# Altium schematic sheet motor subsheet 1.SchDoc
size A3
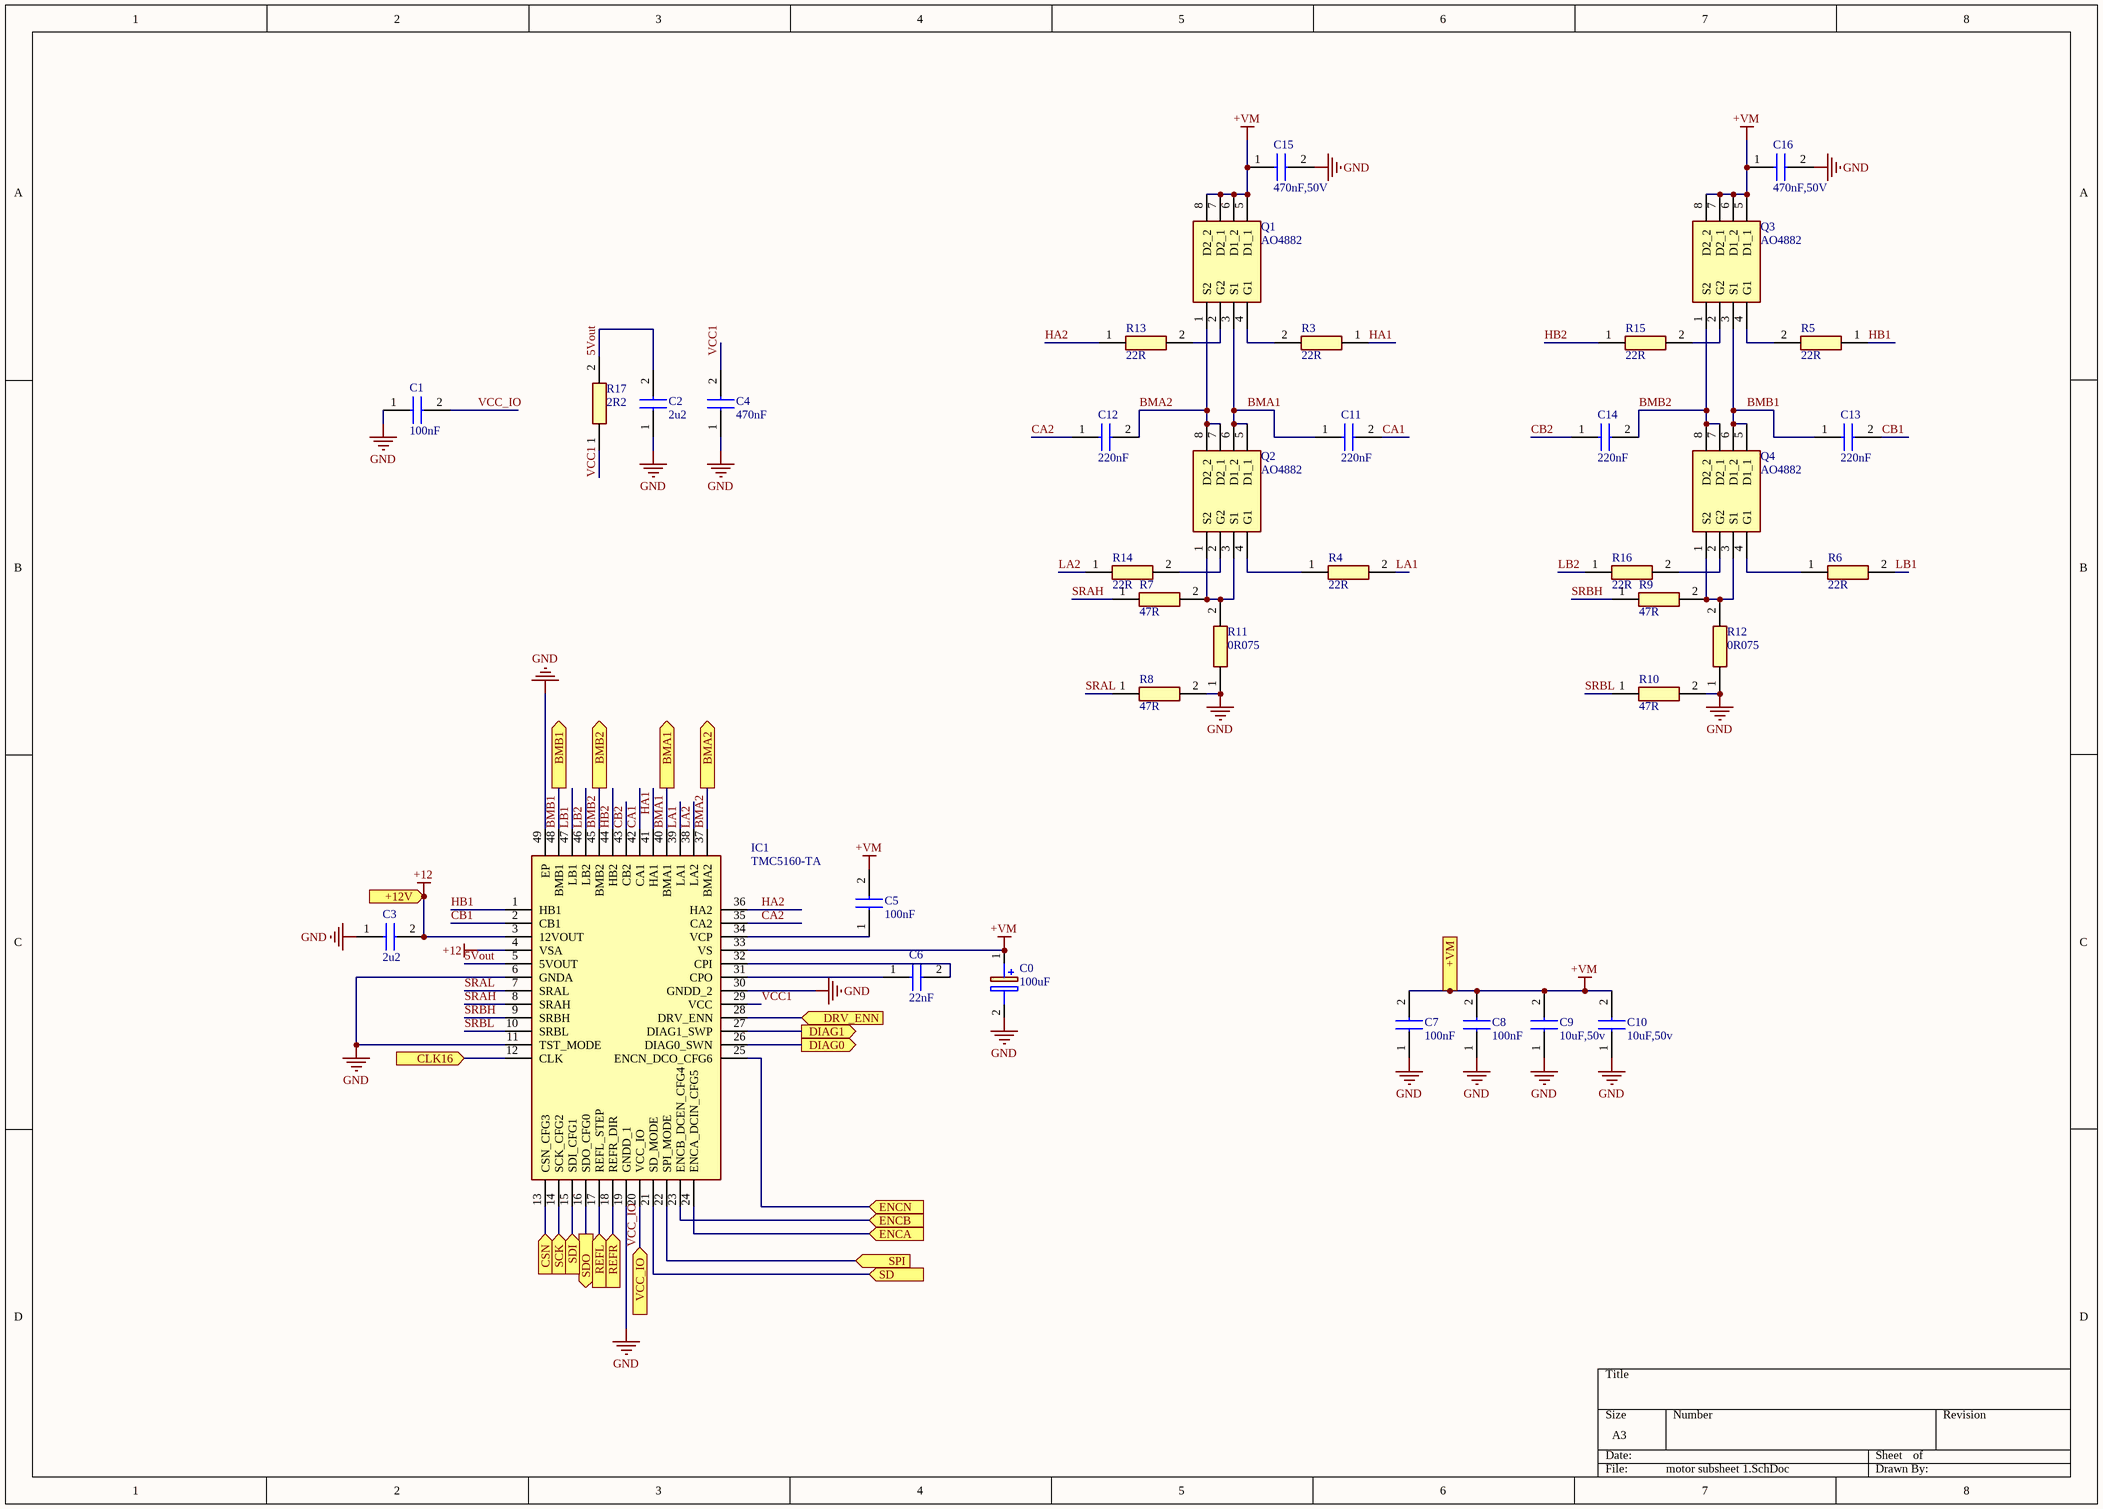
[diagram p0: motor subsheet 1.SchDoc]

## Parts
C0  100uF  [CAPAE850X1050N]
C1  100nF  [CAPC1608X90N]
C2  2u2  [CAPC1608X90N]
C3  2u2  [CAPC1608X90N]
C4  470nF  [CAPC1608X90N]
C5  100nF  [CAPC1608X90N]
C6  22nF  [CAPC1608X90N]
C7  100nF  [CAPC1608X90N]
C8  100nF  [CAPC1608X90N]
C9  10uF,50v  [CAPC3216X180N]
C10  10uF,50v  [CAPC3216X180N]
C11  220nF  [CAPC1608X90N]
C12  220nF  [CAPC1608X90N]
C13  220nF  [CAPC1608X90N]
C14  220nF  [CAPC1608X90N]
C15  470nF,50V  [C1608_Commercial]
C16  470nF,50V  [C1608_Commercial]
IC1  TMC5160-TA  [QFP50P900X900X120-49N]
Q1  AO4882  [SOIC127P600X175-8N]
Q2  AO4882  [SOIC127P600X175-8N]
Q3  AO4882  [SOIC127P600X175-8N]
Q4  AO4882  [SOIC127P600X175-8N]
R3  22R  [RESC1608X55N]
R4  22R  [RESC1608X55N]
R5  22R  [RESC1608X55N]
R6  22R  [RESC1608X55N]
R7  47R  [RESC1608X60N]
R8  47R  [RESC1608X60N]
R9  47R  [RESC1608X60N]
R10  47R  [RESC1608X60N]
R11  0R075  [ERJ8_B_BW_R_LW_CW_D]
R12  0R075  [ERJ8_B_BW_R_LW_CW_D]
R13  22R  [RESC1608X55N]
R14  22R  [RESC1608X55N]
R15  22R  [RESC1608X55N]
R16  22R  [RESC1608X55N]
R17  2R2  [RESC1608X55N]

## Ports
+12V (in), +VM (in), BMA1 (out), BMA2 (out), BMB1 (out), BMB2 (out), CLK16 (in), CSN (in), DIAG0 (out), DIAG1 (out), DRV_ENN (in), ENCA (in), ENCB (in), ENCN (in), REFL (in), REFR (in), SCK (in), SD (in), SDI (in), SDO (out), SPI (in), VCC_IO (in)

## Nets
+12: C3.2 IC1.3(12VOUT) IC1.4(VSA) ; port +12V
+VM: C0.1(+) C5.2 C7.2 C8.2 C9.2 C10.2 C15.1 C16.1 IC1.33(VS) Q1.5(D1_1) Q1.6(D1_2) Q1.7(D2_1) Q1.8(D2_2) Q3.5(D1_1) Q3.6(D1_2) Q3.7(D2_1) Q3.8(D2_2) ; port +VM
GND: C0.2(-) C1.1 C2.1 C3.1 C4.1 C7.1 C8.1 C9.1 C10.1 C15.2 C16.2 IC1.6(GNDA) IC1.11(TST_MODE) IC1.19(GNDD_1) IC1.30(GNDD_2) IC1.49(EP) R8.2 R10.2 R11.1 R12.1
5Vout: C2.2 IC1.5(5VOUT) R17.2
BMA1: C11.1 IC1.40(BMA1) Q1.3(S1) Q2.5(D1_1) Q2.6(D1_2) ; port BMA1
BMA2: C12.2 IC1.37(BMA2) Q1.1(S2) Q2.7(D2_1) Q2.8(D2_2) ; port BMA2
BMB1: C13.1 IC1.48(BMB1) Q3.3(S1) Q4.5(D1_1) Q4.6(D1_2) ; port BMB1
BMB2: C14.2 IC1.45(BMB2) Q3.1(S2) Q4.7(D2_1) Q4.8(D2_2) ; port BMB2
CA1: C11.2 IC1.42(CA1)
CA2: C12.1 IC1.35(CA2)
CB1: C13.2 IC1.2(CB1)
CB2: C14.1 IC1.43(CB2)
CLK16: IC1.12(CLK) ; port CLK16
CSN: IC1.13(CSN_CFG3) ; port CSN
DIAG0: IC1.26(DIAG0_SWN) ; port DIAG0
DIAG1: IC1.27(DIAG1_SWP) ; port DIAG1
DRV_ENN: IC1.28(DRV_ENN) ; port DRV_ENN
ENCA: IC1.24(ENCA_DCIN_CFG5) ; port ENCA
ENCB: IC1.23(ENCB_DCEN_CFG4) ; port ENCB
ENCN: IC1.25(ENCN_DCO_CFG6) ; port ENCN
HA1: IC1.41(HA1) R3.1
HA2: IC1.36(HA2) R13.1
HB1: IC1.1(HB1) R5.1
HB2: IC1.44(HB2) R15.1
LA1: IC1.39(LA1) R4.2
LA2: IC1.38(LA2) R14.1
LB1: IC1.47(LB1) R6.2
LB2: IC1.46(LB2) R16.1
REFL: IC1.17(REFL_STEP) ; port REFL
REFR: IC1.18(REFR_DIR) ; port REFR
SCK: IC1.14(SCK_CFG2) ; port SCK
SD: IC1.21(SD_MODE) ; port SD
SDI: IC1.15(SDI_CFG1) ; port SDI
SDO: IC1.16(SDO_CFG0) ; port SDO
SPI: IC1.22(SPI_MODE) ; port SPI
SRAH: IC1.8(SRAH) R7.1
SRAL: IC1.7(SRAL) R8.1
SRBH: IC1.9(SRBH) R9.1
SRBL: IC1.10(SRBL) R10.1
VCC1: C4.2 IC1.29(VCC) R17.1
VCC_IO: C1.2 IC1.20(VCC_IO) ; port VCC_IO
NetC5_1: C5.1 IC1.34(VCP)
NetC6_1: C6.1 IC1.31(CPO)
NetC6_2: C6.2 IC1.32(CPI)
NetQ1_2: Q1.2(G2) R13.2
NetQ1_4: Q1.4(G1) R3.2
NetQ2_1: Q2.1(S2) Q2.3(S1) R7.2 R11.2
NetQ2_2: Q2.2(G2) R14.2
NetQ2_4: Q2.4(G1) R4.1
NetQ3_2: Q3.2(G2) R15.2
NetQ3_4: Q3.4(G1) R5.2
NetQ4_1: Q4.1(S2) Q4.3(S1) R9.2 R12.2
NetQ4_2: Q4.2(G2) R16.2
NetQ4_4: Q4.4(G1) R6.1

## Library data of the parts
C0 = MAL215097011E3: Capacitor Polarised / MAL215097011E3; Manufacturer_Name: Vishay; Datasheet Link: http://www.vishay.com/docs/28395/150crz.pdf; Height: 10.5mm; Manufacturer_Part_Number: MAL215097011E3; Mouser Part Number: 594-MAL215097011E3; Mouser Price/Stock: https://www.mouser.co.uk/ProductDetail/Vishay-BC-Components/MAL215097011E3?qs=qmStTZH4TzmmMfVG5I6TQQ%3D%3D; Arrow Part Number: MAL215097011E3; Arrow Price/Stock: https://www.arrow.com/en/products/mal215097011e3/vishay
C1-C8 C11-C14 = GCM188R71H224KA64D: Capacitor; Manufacturer_Name: Murata Electronics; Datasheet Link: https://psearch.en.murata.com/capacitor/product/GCM188R71H224KA64%23.html; Height: 0.9mm; Manufacturer_Part_Number: GCM188R71H224KA64D; Mouser Part Number: 81-GCM188R71H224K64D; Mouser Price/Stock: https://www.mouser.co.uk/ProductDetail/Murata-Electronics/GCM188R71H224KA64D?qs=Kk8YaIHLBVBgtUYYs%2FZrtQ%3D%3D; Arrow Part Number: GCM188R71H224KA64D; Arrow Price/Stock: https://www.arrow.com/en/products/gcm188r71h224ka64d/murata-manufacturing
  C1 C5 C7 C8: LCSC Part #: C161181
  C2: LCSC Part #: C77047
  C3: LCSC Part #: *
  C4: LCSC Part #: C170149
  C6: LCSC Part #: C354353
  C11-C14: LCSC Part #: C97857
C9 C10 = GRM31CR61H106MA12L: Capacitor; Manufacturer_Name: Murata Electronics; Datasheet Link: https://datasheet.datasheetarchive.com/originals/distributors/DKDS-10/192395.pdf; Height: 1.8mm; Manufacturer_Part_Number: GRM31CR61H106MA12L; Mouser Part Number: 81-GRM31CR61H106MA2L; Mouser Price/Stock: https://www.mouser.co.uk/ProductDetail/Murata-Electronics/GRM31CR61H106MA12L/?qs=eeBpzGFlv%252B9KISFXBDHybg%3D%3D; Arrow Part Number: GRM31CR61H106MA12L; Arrow Price/Stock: https://www.arrow.com/en/products/grm31cr61h106ma12l/murata-manufacturing?region=europe; LCSC Part #: C882507
C15 C16 = C1608X7R1H474K080AC: Capacitor; Manufacturer_Name: TDK; Datasheet Link: https://product.tdk.com/system/files/dam/doc/product/capacitor/ceramic/mlcc/catalog/mlcc_commercial_general_en.pdf; Height: 0.9mm; Manufacturer_Part_Number: C1608X7R1H474K080AC; Mouser Part Number: 810-C1608X7R1H474K; Mouser Price/Stock: https://www.mouser.co.uk/ProductDetail/TDK/C1608X7R1H474K080AC?qs=NRhsANhppD8WKA9kPBtdag%3D%3D; LCSC Part #: C170149
IC1 = TMC5160-TA: Integrated Circuit; Manufacturer_Name: TRINAMIC; Datasheet Link: https://datasheet.datasheetarchive.com/originals/distributors/DKDS-40/47761.pdf; Height: 1.2mm; Manufacturer_Part_Number: TMC5160-TA; LCSC Part #: C516354
Q1-Q4 = AO4882: MOSFET (N-Channel); Manufacturer_Name: Alpha & Omega Semiconductors; Datasheet Link: http://www.aosmd.com/res/data_sheets/AO4882.pdf; Height: 1.75mm; Manufacturer_Part_Number: AO4882; Arrow Part Number: AO4882; Arrow Price/Stock: https://www.arrow.com/en/products/ao4882/alpha-and-omega-semiconductor?region=nac; LCSC Part #: C3040598
R3-R6 R13-R17 = MC0063W06031100K: Resistor; Manufacturer_Name: MULTICOMP; Datasheet Link: http://uk.farnell.com/multicomp/mc0063w06031105k/res-thick-film-105k-1-0-063w-0603/dp/1170988; Height: 0.55mm; Manufacturer_Part_Number: MC0063W06031100K
  R3-R6 R13-R16: LCSC Part #: C122707
  R17: LCSC Part #: C269422
R7-R10 = MCSR06X47R0FTL: Resistor; Manufacturer_Name: MULTICOMP; Datasheet Link: http://www.farnell.com/datasheets/1716710.pdf?_ga=1.256651403.1411154270.1472651675; Height: 0.6mm; Manufacturer_Part_Number: MCSR06X47R0FTL; LCSC Part #: C2136913
R11 R12 = ERJ-8BWFR075V: Resistor; Manufacturer_Name: Panasonic; Datasheet Link: http://industrial.panasonic.com/cdbs/www-data/pdf/RDN0000/AOA0000C313.pdf; Manufacturer_Part_Number: ERJ-8BWFR075V; Mouser Part Number: 667-ERJ-8BWFR075V; Mouser Price/Stock: https://www.mouser.co.uk/ProductDetail/Panasonic/ERJ-8BWFR075V?qs=KH2o3k57USiX44P74%2FQfRA%3D%3D; Arrow Part Number: ERJ-8BWFR075V; Arrow Price/Stock: https://www.arrow.com/en/products/erj-8bwfr075v/panasonic; LCSC Part #: C388441